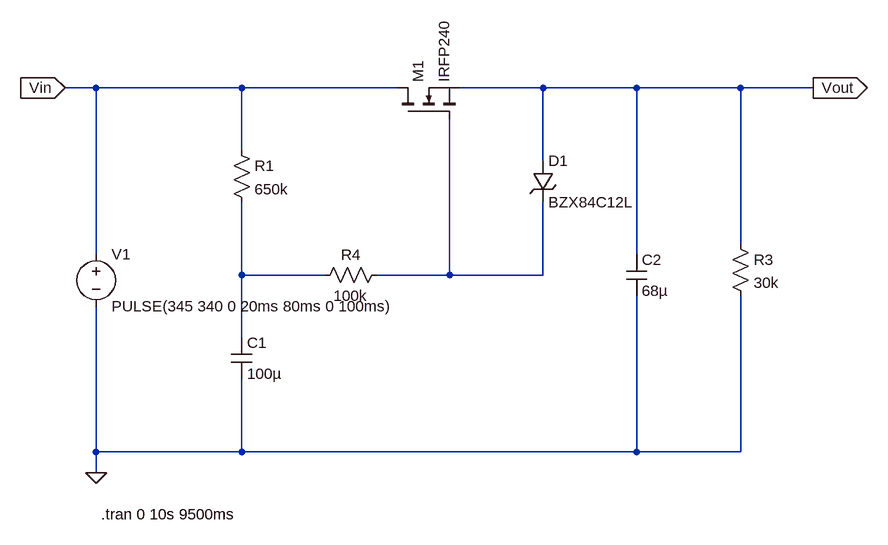
[diagram p0: schematic original_filter.asc]
original_filter.asc, the LTspice schematic file:
Version 4
SHEET 1 1472 680
WIRE 256 -96 208 -96
WIRE 480 -96 256 -96
WIRE 720 -96 480 -96
WIRE 944 -96 816 -96
WIRE 1088 -96 944 -96
WIRE 1248 -96 1088 -96
WIRE 1360 -96 1248 -96
WIRE 480 0 480 -96
WIRE 944 16 944 -96
WIRE 1248 144 1248 -96
WIRE 256 160 256 -96
WIRE 1088 160 1088 -96
WIRE 480 192 480 80
WIRE 608 192 480 192
WIRE 800 192 800 -48
WIRE 800 192 688 192
WIRE 944 192 944 80
WIRE 944 192 800 192
WIRE 480 288 480 192
WIRE 256 464 256 240
WIRE 480 464 480 352
WIRE 480 464 256 464
WIRE 1088 464 1088 224
WIRE 1088 464 480 464
WIRE 1248 464 1248 224
WIRE 1248 464 1088 464
WIRE 256 496 256 464
FLAG 256 496 0
FLAG 208 -96 Vin
IOPIN 208 -96 In
FLAG 1360 -96 Vout
IOPIN 1360 -96 Out
SYMBOL voltage 256 144 R0
WINDOW 123 0 0 Left 0
WINDOW 39 0 0 Left 0
SYMATTR InstName V1
SYMATTR Value PULSE(345 340 0 20ms 80ms 0 100ms)
SYMBOL res 464 -16 R0
SYMATTR InstName R1
SYMATTR Value 650k
SYMBOL cap 464 288 R0
SYMATTR InstName C1
SYMATTR Value 100µ
SYMBOL nmos 720 -48 R270
SYMATTR InstName M1
SYMATTR Value IRFP240
SYMBOL cap 1072 160 R0
SYMATTR InstName C2
SYMATTR Value 68µ
SYMBOL res 1232 128 R0
SYMATTR InstName R3
SYMATTR Value 30k
SYMBOL res 704 176 R90
WINDOW 0 0 56 VBottom 2
WINDOW 3 32 56 VTop 2
SYMATTR InstName R4
SYMATTR Value 100k
SYMBOL zener 928 16 R0
SYMATTR InstName D1
SYMATTR Value BZX84C12L
SYMATTR Description Diode
SYMATTR Type diode
TEXT 264 560 Left 2 !.tran 0 10s 9500ms

The netlist it stands for:
* original_filter.asc
V1 Vin 0 PULSE(345 340 0 20ms 80ms 0 100ms)
R1 Vin N001 650k
C1 N001 0 100µ
M1 Vin N002 Vout Vout IRFP240
C2 Vout 0 68µ
R3 Vout 0 30k
R4 N002 N001 100k
D1 Vout N002 BZX84C12L
.model D D
.lib standard.dio
.model NMOS NMOS
.model PMOS PMOS
.lib standard.mos
.tran 0 10s 9500ms
.backanno
.end